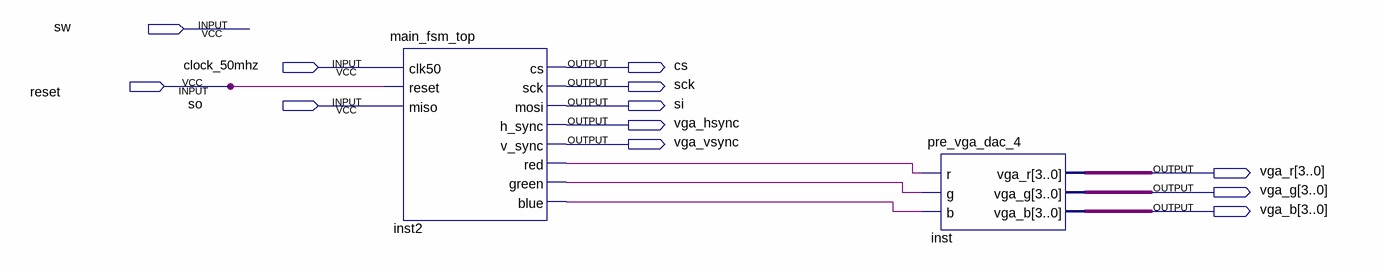
[diagram p0: schematic sheet]
// Quartus schematic top_de1.bdf as structural Verilog: 2 symbols, 12 pins
module top_de1 (
  input  sw,
  input  clock_50mhz,
  input  reset,
  input  so,
  output cs,
  output sck,
  output si,
  output vga_hsync,
  output vga_vsync,
  output [3:0] vga_r,
  output [3:0] vga_g,
  output [3:0] vga_b
);

  wire inst2_blue, inst2_green, inst2_red;

  main_fsm_top inst2 (
    .clk50(clock_50mhz), .reset(reset), .miso(so), .cs(cs), .sck(sck), .mosi(si), .h_sync(vga_hsync),
    .v_sync(vga_vsync), .red(inst2_red), .green(inst2_green), .blue(inst2_blue));
  pre_vga_dac_4 inst (.r(inst2_red), .g(inst2_green), .b(inst2_blue), .vga_r(vga_r), .vga_g(vga_g), .vga_b(vga_b));
endmodule
